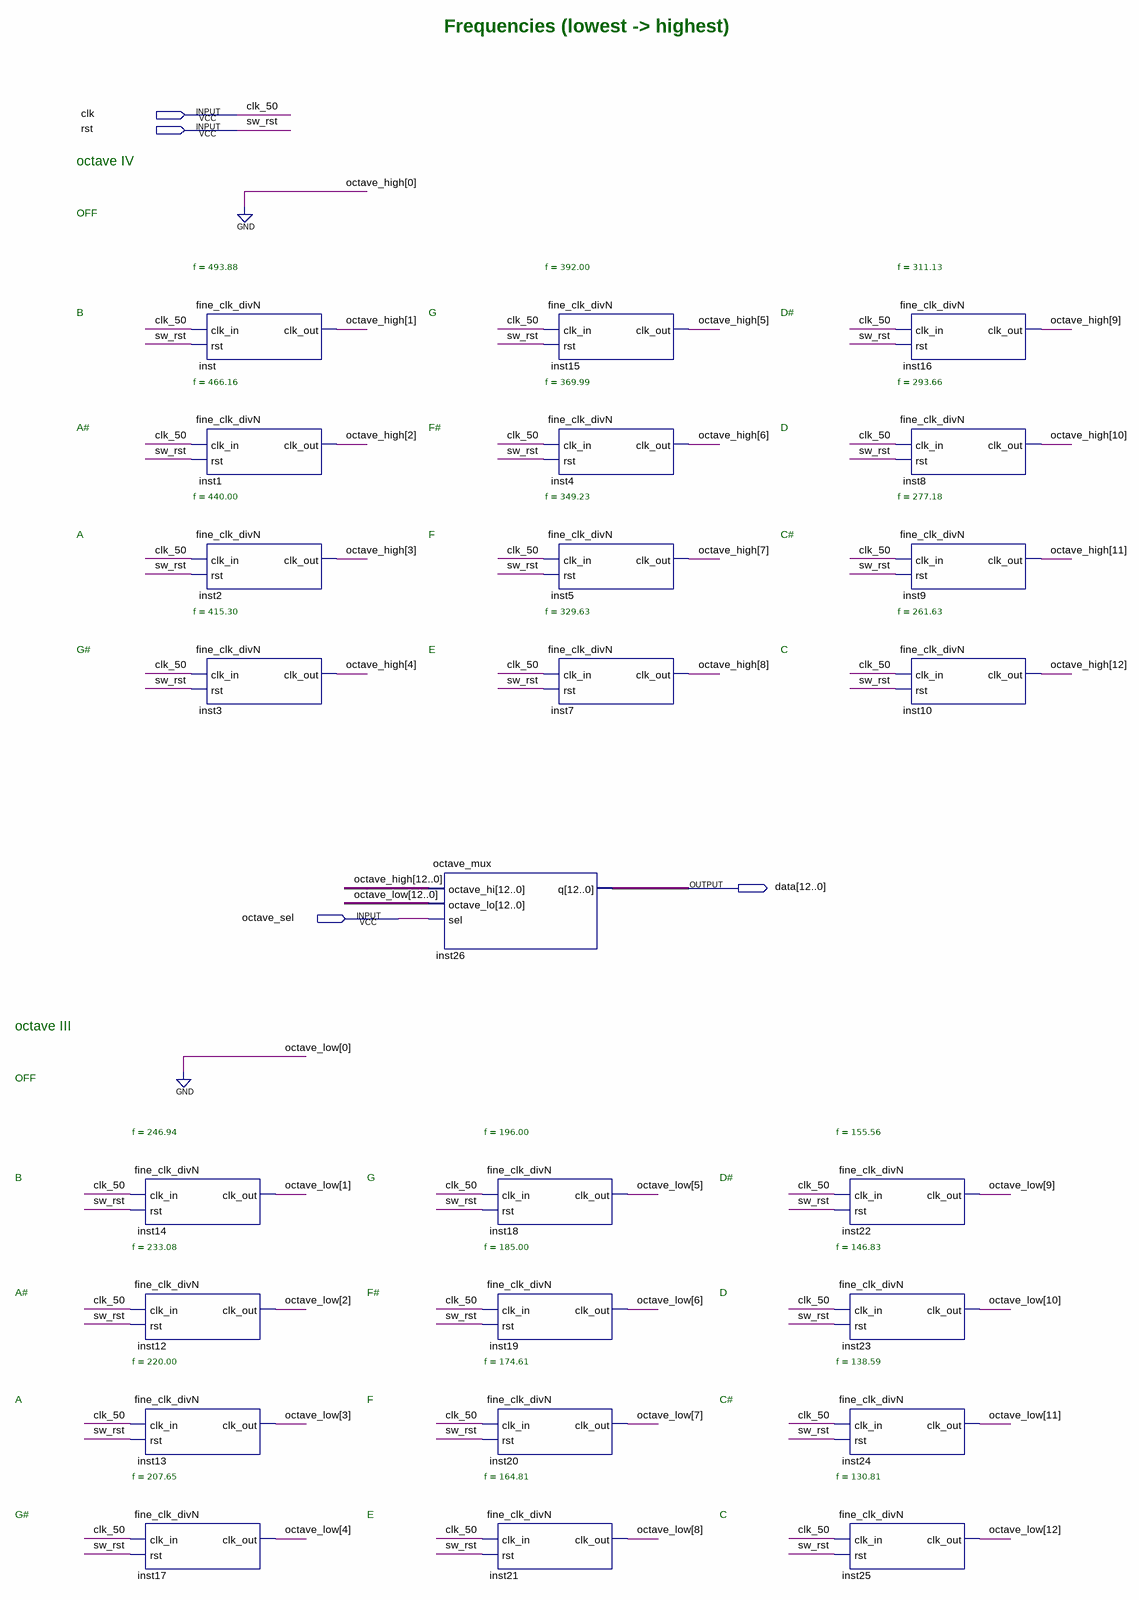
[diagram p0: schematic sheet]
// Quartus schematic music_frequencies.bdf as structural Verilog: 25 symbols, 4 pins
module music_frequencies (
  input  clk,
  input  rst,
  input  octave_sel,
  output [12:0] data
);

  wire [12:1] octave_high, octave_low;

  fine_clk_divN #(.f(246.94)) inst14 (.clk_in(clk), .rst(rst), .clk_out(octave_low[1]));
  fine_clk_divN #(.f(233.08)) inst12 (.clk_in(clk), .rst(rst), .clk_out(octave_low[2]));
  fine_clk_divN #(.f(220.00)) inst13 (.clk_in(clk), .rst(rst), .clk_out(octave_low[3]));
  fine_clk_divN #(.f(207.65)) inst17 (.clk_in(clk), .rst(rst), .clk_out(octave_low[4]));
  fine_clk_divN #(.f(493.88)) inst (.clk_in(clk), .rst(rst), .clk_out(octave_high[1]));
  fine_clk_divN #(.f(466.16)) inst1 (.clk_in(clk), .rst(rst), .clk_out(octave_high[2]));
  fine_clk_divN #(.f(440.00)) inst2 (.clk_in(clk), .rst(rst), .clk_out(octave_high[3]));
  fine_clk_divN #(.f(415.30)) inst3 (.clk_in(clk), .rst(rst), .clk_out(octave_high[4]));
  octave_mux inst26 (.octave_hi({octave_high, 1'b0}), .octave_lo({octave_low, 1'b0}), .sel(octave_sel), .q(data));
  fine_clk_divN #(.f(196.00)) inst18 (.clk_in(clk), .rst(rst), .clk_out(octave_low[5]));
  fine_clk_divN #(.f(185.00)) inst19 (.clk_in(clk), .rst(rst), .clk_out(octave_low[6]));
  fine_clk_divN #(.f(174.61)) inst20 (.clk_in(clk), .rst(rst), .clk_out(octave_low[7]));
  fine_clk_divN #(.f(164.81)) inst21 (.clk_in(clk), .rst(rst), .clk_out(octave_low[8]));
  fine_clk_divN #(.f(392.00)) inst15 (.clk_in(clk), .rst(rst), .clk_out(octave_high[5]));
  fine_clk_divN #(.f(369.99)) inst4 (.clk_in(clk), .rst(rst), .clk_out(octave_high[6]));
  fine_clk_divN #(.f(349.23)) inst5 (.clk_in(clk), .rst(rst), .clk_out(octave_high[7]));
  fine_clk_divN #(.f(329.63)) inst7 (.clk_in(clk), .rst(rst), .clk_out(octave_high[8]));
  fine_clk_divN #(.f(155.56)) inst22 (.clk_in(clk), .rst(rst), .clk_out(octave_low[9]));
  fine_clk_divN #(.f(146.83)) inst23 (.clk_in(clk), .rst(rst), .clk_out(octave_low[10]));
  fine_clk_divN #(.f(138.59)) inst24 (.clk_in(clk), .rst(rst), .clk_out(octave_low[11]));
  fine_clk_divN #(.f(130.81)) inst25 (.clk_in(clk), .rst(rst), .clk_out(octave_low[12]));
  fine_clk_divN #(.f(311.13)) inst16 (.clk_in(clk), .rst(rst), .clk_out(octave_high[9]));
  fine_clk_divN #(.f(293.66)) inst8 (.clk_in(clk), .rst(rst), .clk_out(octave_high[10]));
  fine_clk_divN #(.f(277.18)) inst9 (.clk_in(clk), .rst(rst), .clk_out(octave_high[11]));
  fine_clk_divN #(.f(261.63)) inst10 (.clk_in(clk), .rst(rst), .clk_out(octave_high[12]));

  // Other names for the same wires on the sheet: clk_50 = clk; sw_rst = rst

  // Notes on the sheet:
  //   Frequencies (lowest -> highest)
  //   octave IV
  //   OFF
  //   B
  //   G
  //   D#
  //   A#
  //   F#
  //   D
  //   A
  //   F
  //   C#
  //   G#
  //   E
  //   C
  //   octave III
  //   OFF
  //   B
  //   G
  //   D#
  //   A#
  //   F#
  //   D
  //   A
  //   F
  //   C#
  //   G#
  //   E
  //   C
endmodule
